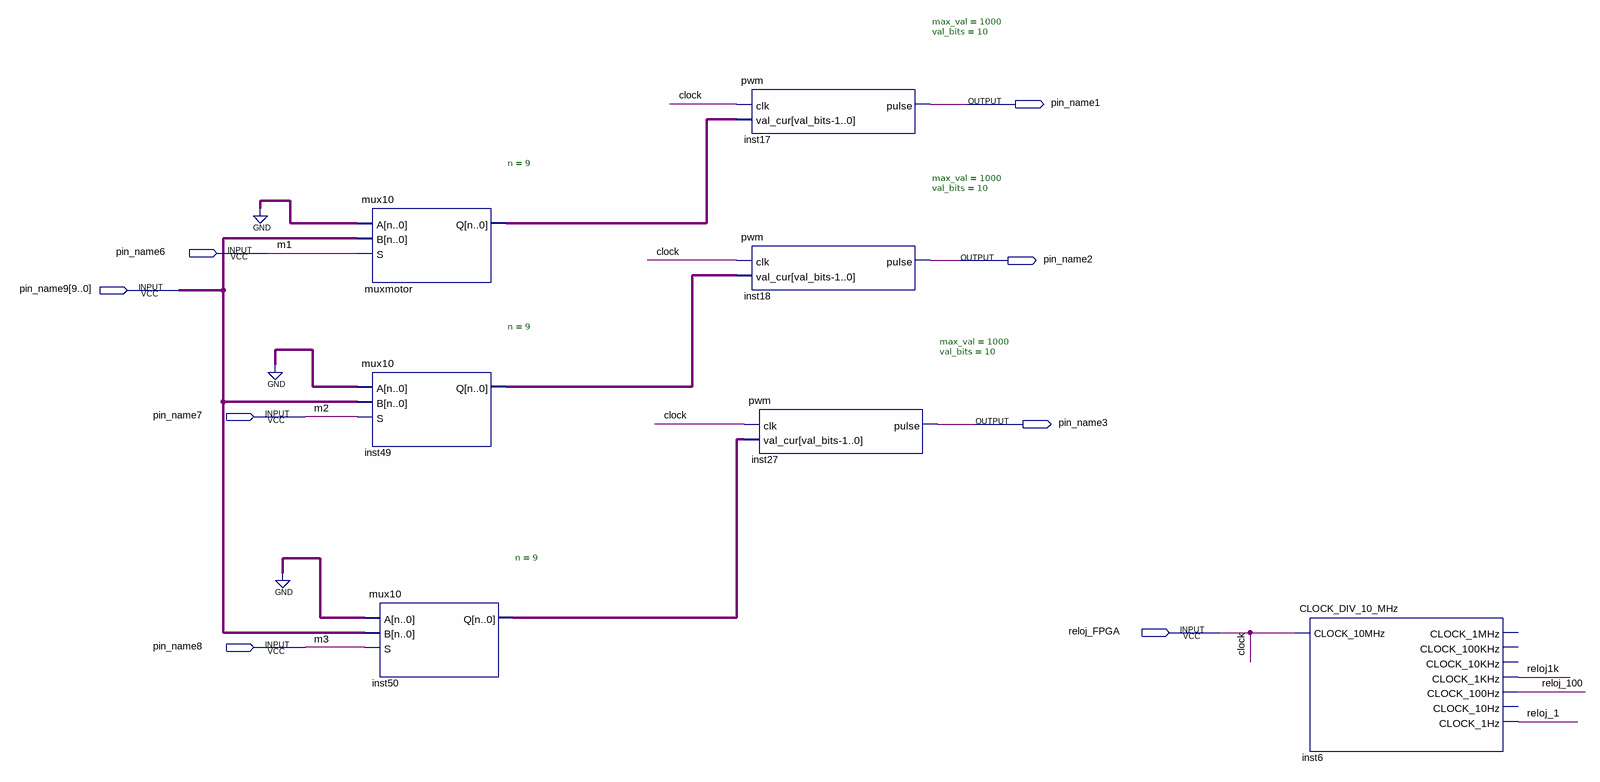
[diagram p0: schematic sheet]
// Quartus schematic Motoresbloques.bdf as structural Verilog: 7 symbols, 8 pins
module Motoresbloques (
  input  pin_name6,
  input  [9:0] pin_name9,
  input  pin_name7,
  input  reloj_FPGA,
  input  pin_name8,
  output pin_name1,
  output pin_name2,
  output pin_name3
);

  wire reloj1k, reloj_1, reloj_100;
  wire [9:0] inst49_q, inst50_q, muxmotor_q;

  mux10 #(.n(9)) muxmotor (.A({10{1'b0}}), .B(pin_name9), .S(pin_name6), .Q(muxmotor_q));
  mux10 #(.n(9)) inst49 (.A({10{1'b0}}), .B(pin_name9), .S(pin_name7), .Q(inst49_q));
  mux10 #(.n(9)) inst50 (.A({10{1'b0}}), .B(pin_name9), .S(pin_name8), .Q(inst50_q));
  pwm #(.max_val(1000), .val_bits(10)) inst17 (.clk(reloj_FPGA), .val_cur(muxmotor_q), .pulse(pin_name1));
  pwm #(.max_val(1000), .val_bits(10)) inst18 (.clk(reloj_FPGA), .val_cur(inst49_q), .pulse(pin_name2));
  pwm #(.max_val(1000), .val_bits(10)) inst27 (.clk(reloj_FPGA), .val_cur(inst50_q), .pulse(pin_name3));
  CLOCK_DIV_10_MHz inst6 (
    .CLOCK_10MHz(reloj_FPGA), .CLOCK_1KHz(reloj1k), .CLOCK_100Hz(reloj_100), .CLOCK_1Hz(reloj_1));  // open: CLOCK_1MHz, CLOCK_100KHz, CLOCK_10KHz, CLOCK_10Hz

  // Other names for the same wires on the sheet: clock = reloj_FPGA; m1 = pin_name6; m2 = pin_name7; m3 = pin_name8
endmodule
